# EAGLE design card (EAGLE 8.3.1)
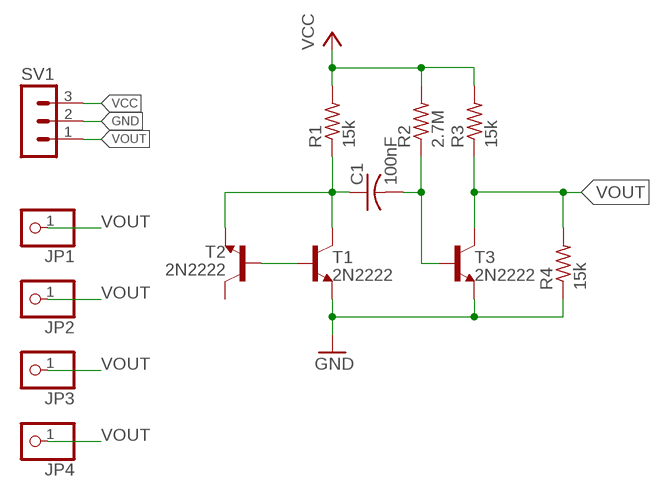
[diagram p0: schematic, sheet 1]

## Parts
C1  100nF  C-US025-025X050  [C025-025X050]
JP1  PINHD-1X1  [1X01]
JP2  PINHD-1X1  [1X01]
JP3  PINHD-1X1  [1X01]
JP4  PINHD-1X1  [1X01]
R1  15k  R-US_0204/7  [0204/7]
R2  2.7M  R-US_0204/7  [0204/7]
R3  15k  R-US_0204/7  [0204/7]
R4  15k  R-US_0204/7  [0204/7]
SV1  MA03-1  [MA03-1]
T1  2N2222  [TO18]
T2  2N2222  [TO18]
T3  2N2222  [TO18]

## Nets
GND: R4.1 SV1.2 T1.1(E) T3.1(E)
N$1: T1.2(B) T2.2(B)
N$2: C1.1 R1.1 T1.3(C) T2.1(E)
N$3: C1.2 R2.1 T3.2(B)
VCC: R1.2 R2.2 R3.2 SV1.3
VOUT: JP1.1 JP2.1 JP3.1 JP4.1 R3.1 R4.2 SV1.1 T3.3(C)
Unconnected: T2.3(C)

## Library data of the parts
C1 = rcl:C-US: CAPACITOR, American symbol
JP1-JP4 = pinhead:PINHD-1X1: PIN HEADER
R1-R4 = resistor:R-US_: RESISTOR, American symbol
SV1 = con-lstb:MA03-1: PIN HEADER; OC_FARNELL: unknown; OC_NEWARK: unknown
T1-T3 = transistor:2N2222: NPN TRANSISTOR

## Board
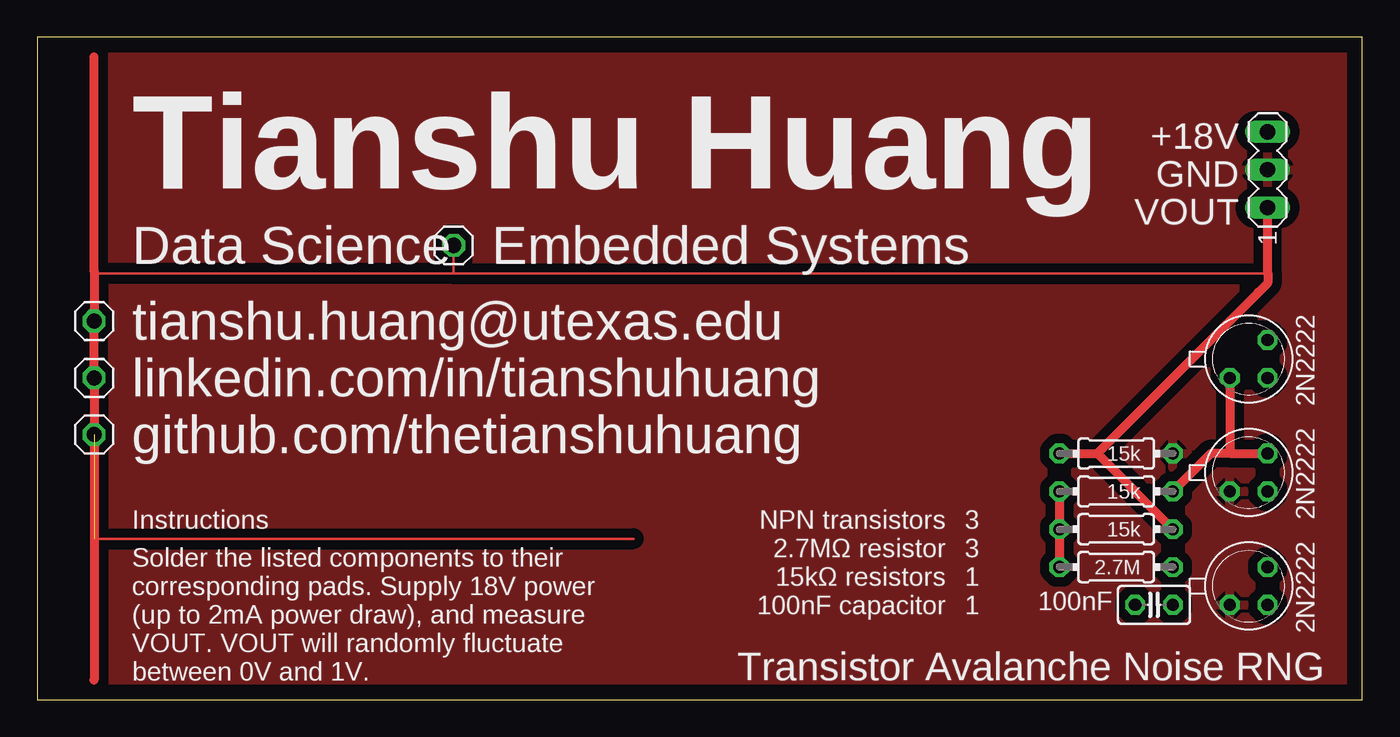
[diagram p1: board, top side]
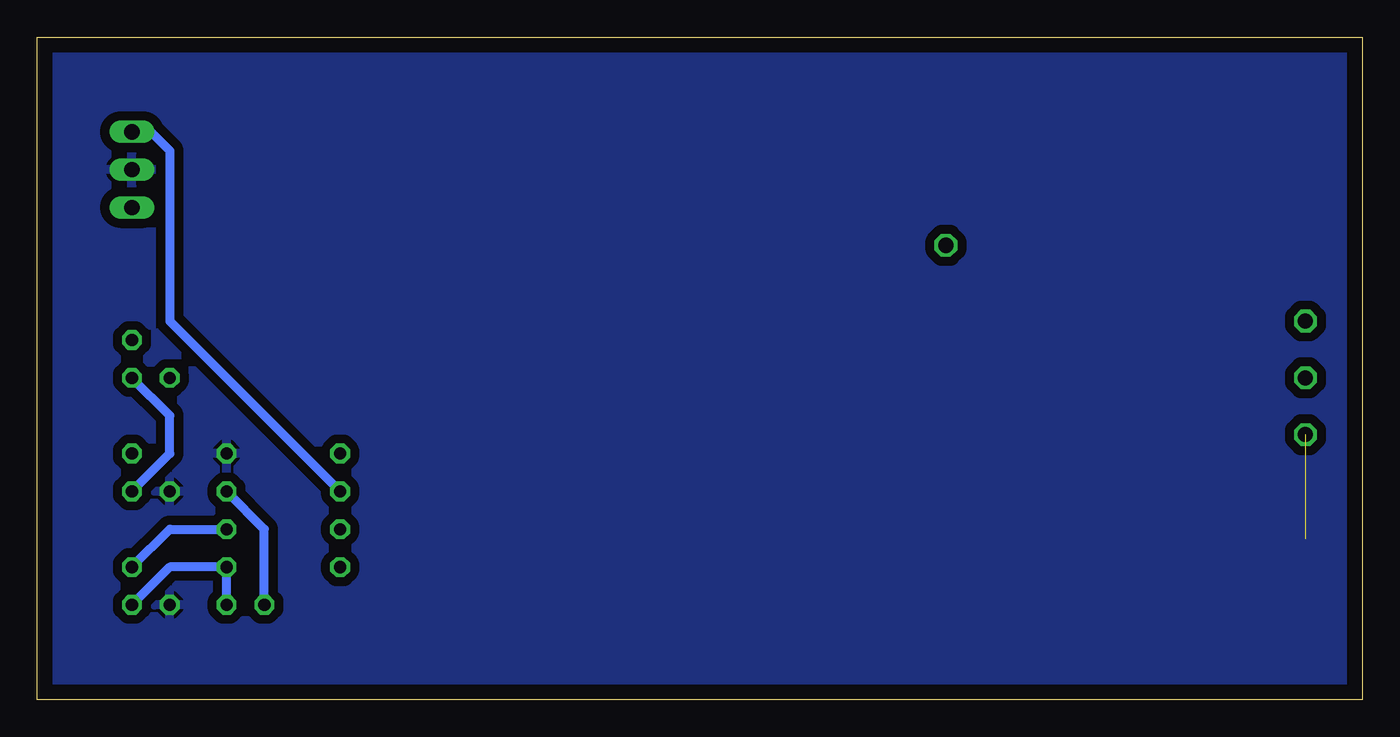
[diagram p2: board, bottom side, seen from below]

Size 88.9 x 44.45 mm. Coordinates in mm from the lower left corner, seen from the top.
Outline: 0,0 88.9,0 88.9,44.45 0,44.45 0,0
Copper layers (1*16): Top 0.035mm / dielectric 1.5mm / Bottom 0.035mm
Design rules "default": minimum track width 6mil, minimum drill 0.35mm, track to track 6mil, track to pad 6mil, pad to pad 6mil, via to via 6mil, smd to smd 6mil, copper to edge 40mil, drill to drill 6mil, minimum pad ring 10mil, minimum via ring 8mil, stop-mask expansion 4mil, vias tented up to drill 0mil, thermal gap 10mil

### Footprints (pad centres in the part's own frame; a part is rotated, then mirrored left to right if it is on the bottom)
C025-025X050 = drill 0.813 octagon: 1 -1.27,0; 2 1.27,0
1X01 = drill 1.016 octagon: 1 0,0
0204/7 = drill 0.813 octagon: 1 -3.81,0; 2 3.81,0
MA03-1 = drill 1.016 long: 1 -2.54,0; 2 0,0; 3 2.54,0
TO18 = drill 0.813 octagon: 1 -1.27,-1.27; 2 1.27,-1.27; 3 1.27,1.27

### Placement (x,y rotation side)
C1  74.93,6.35 0 top
JP1  3.81,25.4 0 top
JP2  3.81,21.59 0 top
JP3  3.81,17.78 0 top
JP4  27.94,30.48 0 top
R1  72.39,13.97 180 top
R2  72.39,8.89 180 top
R3  72.39,11.43 180 top
R4  72.39,16.51 180 top
SV1  82.55,35.56 90 top
T1  81.28,15.24 0 top
T2  81.28,22.86 0 top
T3  81.28,7.62 0 top

### Tracks (layer width: path | path; a pad name or v marks a point on that pad's centre or on a via)
GND
  pour Top (isolate 0.635): 0,44.45 0,0 88.9,0 88.9,44.45
  pour Bottom (isolate 0.61): 0,44.45 0,0 88.9,0 88.9,44.45
N$1
  Bottom 0.61: T1.2 80.01,16.51 80.01,19.05 T2.2
N$2
  Top 0.61: R1.1 78.74,16.51 80.14,16.51 | 80.14,16.51 T1.3 | T2.1 80.01,16.64 80.14,16.51
  Bottom 0.61: C1.1 73.66,11.43 R1.1
N$3
  Bottom 0.61: T3.2 80.01,8.89 R2.1 C1.2
VCC
  Top 0.61: R1.2 R3.2 R2.2
  Bottom 0.61: SV1.3 81.28,38.1 80.01,36.83 80.01,25.4 R1.2
VOUT  (1 unrouted)
  Top 0.152: 81.92,27.3 81.93,27.32 | JP4.1 27.94,28.57 | 27.94,28.57 4.01,28.57 3.81,28.78 | 27.94,28.57 82.46,28.57 82.55,28.66 | 3.81,10.79 40.01,10.79
  Top 0.61: R4.2 71.12,16.51 | 71.12,16.51 R3.1 | 71.12,16.51 81.93,27.32 82.55,27.94 82.55,28.66 SV1.1 | 3.81,43.13 3.81,28.78 JP1.1 JP2.1 JP3.1 3.81,1.32
  Bottom 0.61: T3.3 80.01,11.43 R3.1

### Text on the board
tPlace: +18V | GND | Tianshu Huang | VOUT | Data Science | Embedded Systems | tianshu.huang@utexas.edu | linkedin.com/in/tianshuhuang | github.com/thetianshuhuang | NPN transistors / 2.7MΩ resistor / 15kΩ resistors / 100nF capacitor | 3 / 3 / 1 / 1 | Instructions | Solder the listed components to their / corresponding pads. Supply 18V power / (up to 2mA power draw), and measure / VOUT. VOUT will randomly fluctuate / between 0V and 1V. | Transistor Avalanche Noise RNG